# Altium schematic sheet SI7005 Humidity Sensor I2c.SchDoc
size A4
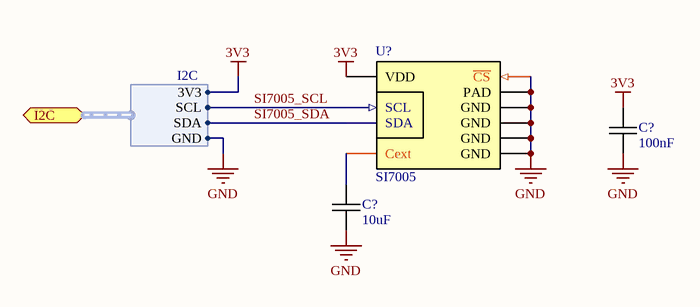
[diagram p0: SI7005 Humidity Sensor I2c.SchDoc]

## Parts
(Parts that share a designator on the sheet are numbered #1, #2 ... from top to bottom, then left to right.)
C?#1  100nF  [0603C-GENERIC]
C?#2  10uF  [0805C-GENERIC]
U?  SI7005  [QFN24]

## Ports
I2C (harness I2C)

## Harnesses
I2C: SCL, SDA, 3V3, GND

## Nets
3V3: C?#1.1 U?.9(VDD) ; port I2C.3V3
GND: C?#1.2 C?#2.2 U?.1(GND) U?.8(GND) U?.11(GND) U?.15(~{CS}) U?.19(GND) U?.25(PAD) ; port I2C.GND
SI7005_SCL: U?.3(SCL) ; port I2C.SCL
SI7005_SDA: U?.4(SDA) ; port I2C.SDA
NetC?#2_1: C?#2.1 U?.10(Cext)

## Library data of the parts
C?#1 = 0603C-100NF-50V-X7R-TDK: CAPACITOR 0603 CERAMIC; Manufacturer Part Number: C1608X7R1H103K; Manufacturer: TDK Corporation; Temperature Coefficient: X7R; Tolerance: ±10%; Voltage - Rated: 50V; Capacitance: 10000pF; Reel: C68; RoHS: RoHS Compliant; Lead Spacing: -; Package / Case: 0603 (1608 metric); Features: General Purpose; Packaging: Tape & Reel (TR); Thickness: 0.80mm; Operating Temperature: -55°C ~ 125°C; Mounting Type: Surface Mount, MLCC; Category: Capacitors; Supplier 1: Digi-Key; Supplier Part Number 1: 445-1314-2-ND
C?#2 = 0805C-4U7-25V-X5R-TDK: CAPACITOR 0805 CERAMIC; Manufacturer: TDK Corporation; Manufacturer Part Number: C2012X5R1E475K; Tolerance: ±10%; Voltage - Rated: 25V; Temperature Coefficient: X5R; Capacitance: 4.7µF; REEL: C102; Supplier 1: Digi-Key; Supplier Part Number 1: 445-4116-1-ND; Packaging: Cut Tape (CT); Operating Temperature: -55°C ~ 85°C; Supplier: Digi-Key; Thickness: 1.25mm; RoHS: RoHS Compliant; Features: General Purpose; Mounting Type: Surface Mount, MLCC; Package / Case: 0805 (2012 Metric); Lead Spacing: -; Category: Capacitors; Supplier Part Number: 445-4116-1-ND
U? = SI7005: I2c humidity and themperature sensor